# EAGLE design cell (EAGLE 7.5.0)
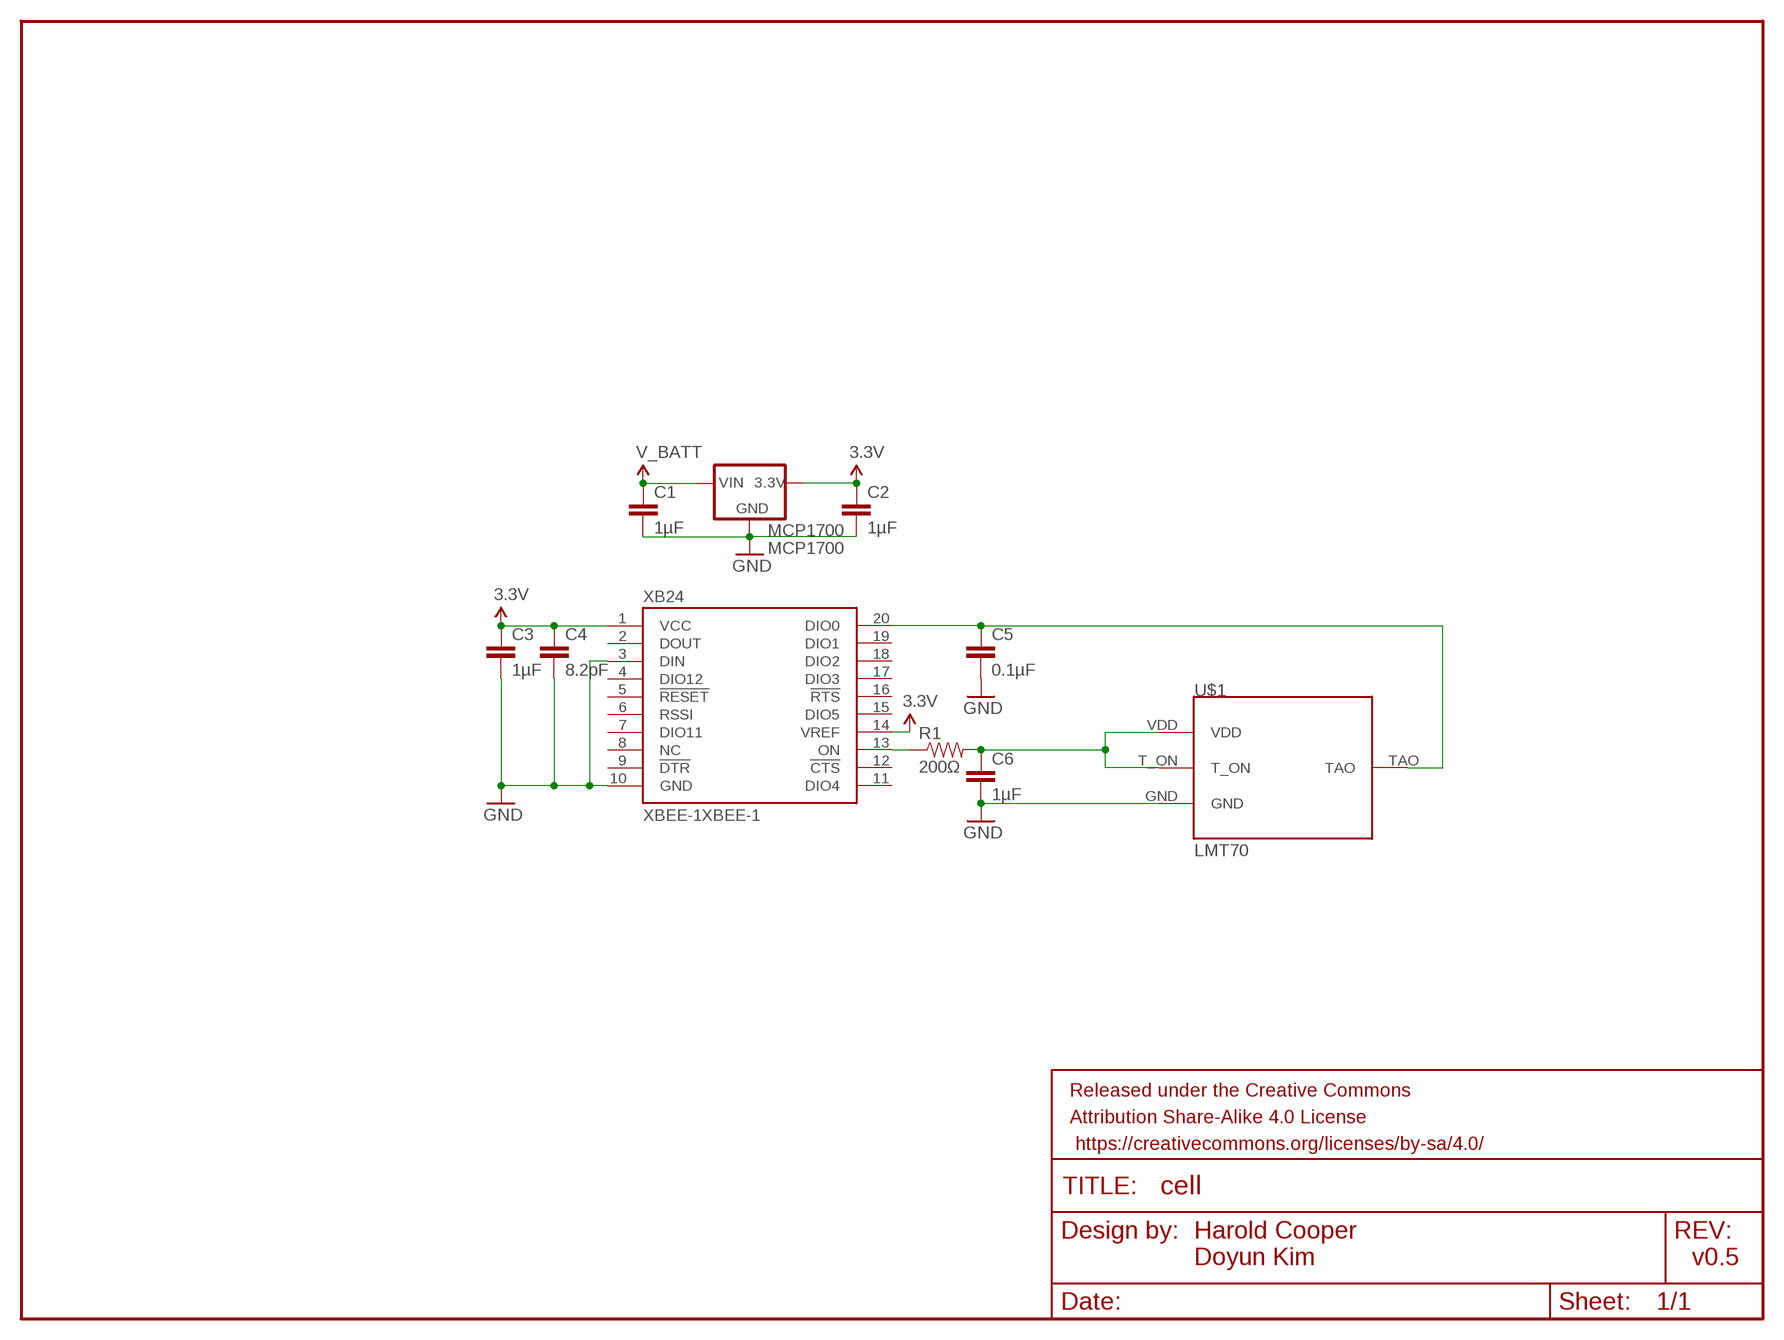
[diagram p0: schematic, sheet 1]

## Parts
C1  1µF  CAP0805  [0805]
C2  1µF  CAP0805  [0805]
C3  1µF  CAP0805  [0805]
C4  8.2pF  CAP0805  [0805]
C5  0.1µF  CAP0805  [0805]
C6  1µF  CAP0805  [0805]
FRAME1  FRAME-LETTER  [CREATIVE_COMMONS]
MCP1700  MCP1700  [SOT-89-3]
R1  200Ω  RESISTOR0805-RES  [0805]
U$1  LMT70  [YFP0004]
XB24  XBEE-1XBEE-1  [XBEE-1]

## Nets
3.3V: C2.1 C3.1 C4.1 MCP1700.3(3.3V) XB24.1(VCC) XB24.14(VREF)
GND: C1.2 C2.2 C3.2 C4.2 C5.2 C6.2 MCP1700.1(GND) U$1.GND XB24.3(DIN) XB24.10(GND)
N$1: C6.1 R1.2 U$1.T_ON U$1.VDD
N$2: R1.1 XB24.13(ON)
N$7: C5.1 U$1.TAO XB24.20(DIO0)
V_BATT: C1.1 MCP1700.2(IN)
Unconnected: XB24.2(DOUT) XB24.4(DIO12) XB24.5(!RESET) XB24.6(RSSI) XB24.7(DIO11) XB24.8(NC) XB24.9(!DTR) XB24.11(DIO4) XB24.12(!CTS) XB24.15(DIO5) XB24.16(!RTS) XB24.17(DIO3) XB24.18(DIO2) XB24.19(DIO1)

## Notes on the sheet
- Harold Cooper
  Doyun Kim
- v0.5

## Library data of the parts
C1-C6 = SparkFun-Capacitors:CAP: Capacitor Standard 0603 ceramic capacitor, and 0.1" leaded capacitor.
FRAME1 = SparkFun-Aesthetics:FRAME-LETTER: Schematic Frame Standard 8.5x11 US Letter frame
MCP1700 = hrldcpr:MCP1700
R1 = SparkFun-Resistors:RESISTOR: Resistor Basic schematic elements and footprints for 0603, 1206, and PTH resistors.
U$1 = lmt70:LMT70
XB24 = hrldcpr:XBEE-1: Xbee module footprints SMT header is CONN-09042.

## Board
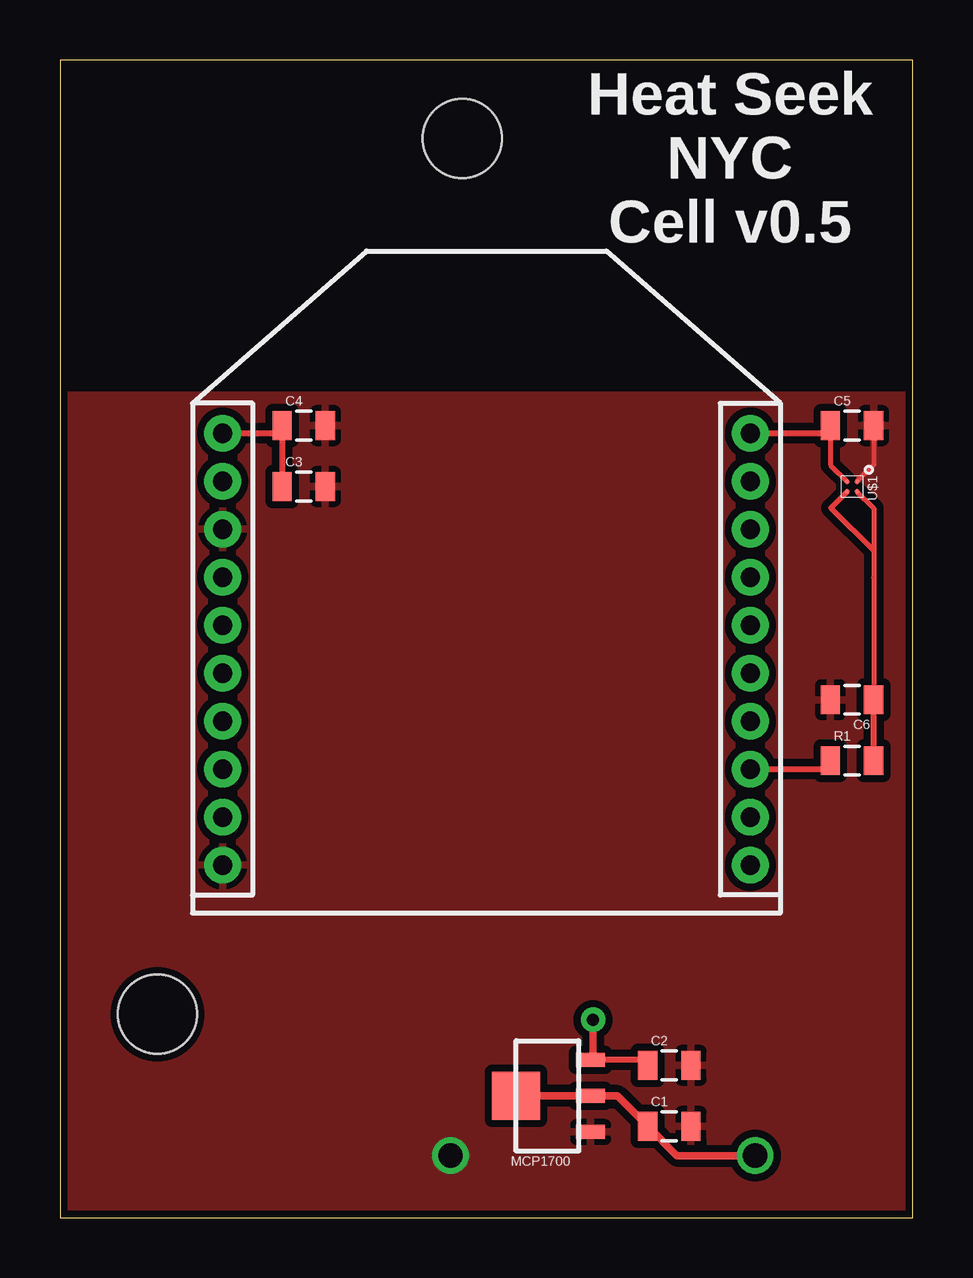
[diagram p1: board, top side]
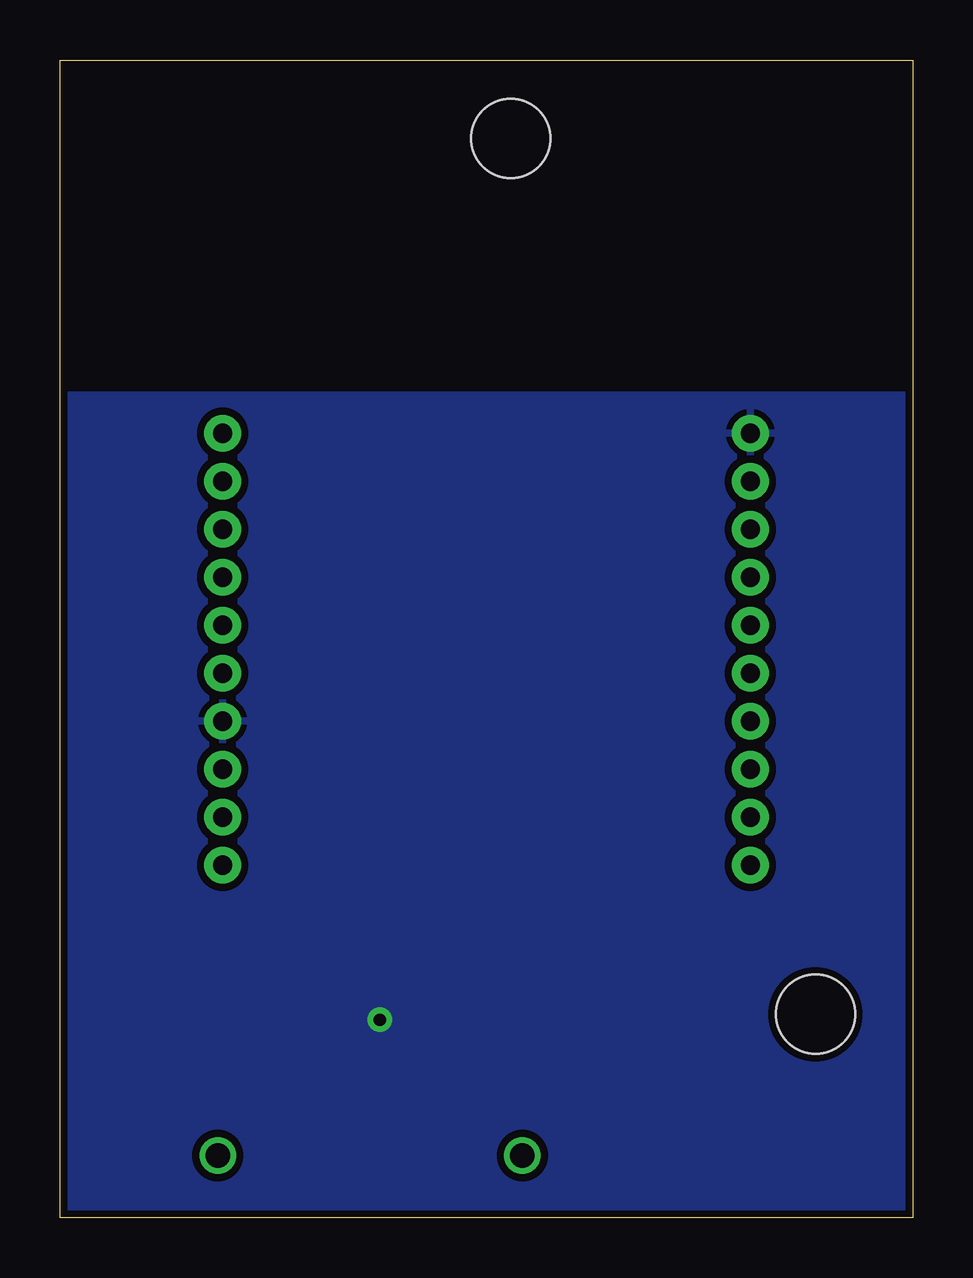
[diagram p2: board, bottom side, seen from below]

Size 35.56 x 48.26 mm. Coordinates in mm from the lower left corner, seen from the top.
Outline: 0,0 35.56,0 35.56,48.26 0,48.26 0,0
Copper layers (1*16): Top 0.035mm / dielectric 1.5mm / Bottom 0.035mm
Design rules "SparkFun-2-layer *": minimum track width 5mil, minimum drill 15mil, track to track 6mil, track to pad 6mil, pad to pad 6mil, via to via 6mil, smd to smd 6mil, copper to edge 5mil, drill to drill 5mil, minimum pad ring 12mil, minimum via ring 10mil, stop-mask expansion 4mil, vias tented up to drill 20mil, thermal gap 10mil
Holes 3.3 mm at 4.06,8.48 16.76,44.98

### Footprints (pad centres in the part's own frame; a part is rotated, then mirrored left to right if it is on the bottom)
0805 = smd 0.8 x 1.2: 1 -0.9,0; 2 0.9,0
SOT-89-3 = smd 0.58 x 1.2: 1 -1.5,-1.8; 2 0,-1.8; 3 1.5,-1.8 | smd 2 x 2: 4 0,1.3
YFP0004 = smd 0.205 x 0.205: GND -0.2,0.2; T_ON 0.2,-0.2; TAO -0.2,-0.2; VDD 0.2,0.2
XBEE-1 = drill 0.8 pad 1.524: 1 -11,20; 2 -11,18; 3 -11,16; 4 -11,14; 5 -11,12; 6 -11,10; 7 -11,8; 8 -11,6; 9 -11,4; 10 -11,2; 11 11,2; 12 11,4; 13 11,6; 14 11,8; 15 11,10; 16 11,12; 17 11,14; 18 11,16; 19 11,18; 20 11,20

### Placement (x,y rotation side)
C1  25.4,3.81 0 top
C2  25.4,6.35 0 top
C3  10.16,30.48 0 top
C4  10.16,33.02 0 top
C5  33.02,33.02 0 top
C6  33.02,21.59 180 top
FRAME1  0,60 0 top  (outside the outline)
MCP1700  20.32,5.08 90 top
R1  33.02,19.05 0 top
U$1  33.02,30.48 270 top
XB24  17.78,12.7 0 top

### Tracks (layer width: path | path; a pad name or v marks a point on that pad's centre or on a via)
3.3V  (via drill 0.51)
  Top 0.254: C3.1 C4.1 9.26,32.7 XB24.1 | C2.1 24.5,6.58 MCP1700.3
  Top 0.305: v22.23,8.26 22.23,6.58 MCP1700.3
  pour Bottom (isolate 0.305): 0,0 0,34.29 35.56,34.29 35.56,0
GND  (via drill 1.02)
  Top 0.206: C5.2 33.92,31.38 U$1.GND
  other vias: 16.28,2.59
  pour Top (isolate 0.305): 0,0 0,34.29 35.56,34.29 35.56,0
N$1
  Top 0.206: U$1.VDD 33.92,29.58 33.92,27.8 | C6.1 33.92,26.67 33.92,27.8 | U$1.T_ON 32.13,29.59 33.92,27.8
  Top 0.254: R1.2 C6.1 33.97,21.59
N$2
  Top 0.254: XB24.13 32.12,18.7 R1.1
N$5
  Top 0.305: 21.59,5.08 19.05,5.08
N$7
  Top 0.206: 32.12,32.7 32.12,31.38 U$1.TAO
  Top 0.254: XB24.20 32.12,32.7 C5.1
V_BATT  (via drill 1.02)
  Top 0.305: v28.98,2.59 25.72,2.59 C1.1 23.23,5.08 MCP1700.2

### Text on the board
tPlace: Heat Seek / NYC / Cell v0.5
tDocu: Harold Cooper, Doyun Kim